# Altium project Signal_Jammer_SMD.PrjPcb
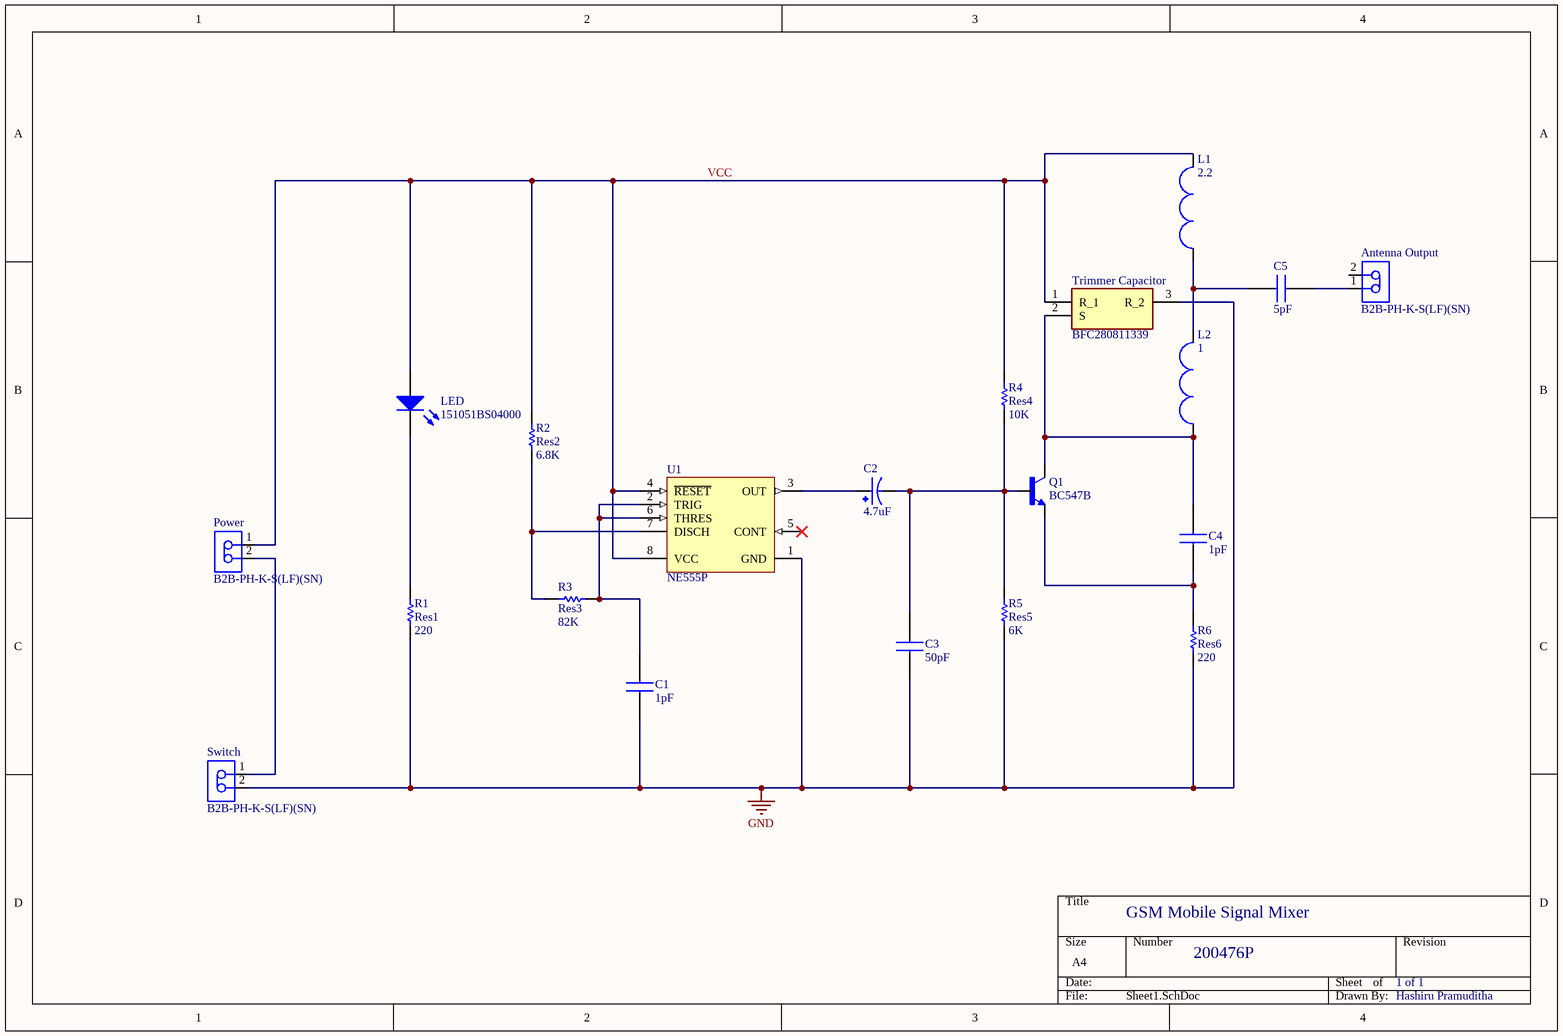
[diagram p0: Sheet1.SchDoc]
1 sheet, 20 parts. Net scope: global (net labels, ports and power ports of the same name join across sheets).
Board file: JammerCircuit_PCB.PcbDoc

## Sheet Sheet1.SchDoc
size A4; SheetNumber: 1; SheetTotal: 1

### Parts
Antenna_Output  B2B-PH-K-S(LF)(SN)  [JST-B2B-PH-K-S_V]
C1  1pF  [RDE5C1H330J0M1H03A]
C2  4.7uF  [CAPPRD250W50D500H1100]
C3  50pF  [RDE5C1H330J0M1H03A]
C4  1pF  [RDE5C1H330J0M1H03A]
C5  5pF  [RDE5C1H330J0M1H03A]
L1  2.2  [Inductor Coil TH]
L2  1  [Inductor Coil TH]
LED  151051BS04000  [Type 5mm]
Power  B2B-PH-K-S(LF)(SN)  [JST-B2B-PH-K-S_V]
Q1  BC547B  [TO92250P510H770-3]
R1  Res1  value 220  [AXIAL-0.3]
R2  Res2  value 6.8K  [AXIAL-0.3]
R3  Res3  value 82K  [AXIAL-0.3]
R4  Res4  value 10K  [AXIAL-0.3]
R5  Res5  value 6K  [AXIAL-0.3]
R6  Res6  value 220  [AXIAL-0.3]
Switch  B2B-PH-K-S(LF)(SN)  [JST-B2B-PH-K-S_V]
Trimmer_Capacitor  BFC280811339  [BFC280811339]
U1  NE555P  [P0008A]

### Nets
GND: C1.1 C3.1 R1.1 R5.1 R6.1 Switch.2 Trimmer_Capacitor.3(R_2) U1.1(GND)
NetAntenna_Output_1: Antenna_Output.1 C5.2
NetC1_2: C1.2 R3.2 U1.2(TRIG) U1.6(THRES)
NetC2_N: C2.N C3.2 Q1.2(B) R4.1 R5.2
NetC2_P: C2.P U1.3(OUT)
NetC4_1: C4.1 Q1.3(E) R6.2
NetC4_2: C4.2 L2.0 Q1.1(C) Trimmer_Capacitor.2(S)
NetC5_1: C5.1 L1.0 L2.1
NetL1_1: L1.1 LED.2(A) Power.1 R2.2 R4.2 Trimmer_Capacitor.1(R_1) U1.4(~{RESET}) U1.8(VCC)
NetLED_1: LED.1(K) R1.2
NetPower_2: Power.2 Switch.1
NetR2_1: R2.1 R3.1 U1.7(DISCH)

Not connected (* = marked no-connect by the designer): Antenna_Output 2; U1 5(CONT)*

### Notes on the sheet
- VCC
- GSM Mobile Signal Mixer
- 200476P
- 1 of 1
- Hashiru Pramuditha

### Library data of the parts
Antenna_Output Power Switch = CMP-2000-05162-1: Male Header, Pitch 2 mm, 1 x 2 Position, Height 6 mm, Tail Length 3.4 mm, -25 to 85 degC, RoHS, Bulk; Manufacturer: JST; Pitch: 2mm; Style/Orientation: StraightHeader/Plug; No of Positions: 2; Datasheet Version: Nov-08; Datasheet URL: http://datasheet.octopart.com/B2B-PH-K-S%28LF%29%28SN%29-JST-datasheet-8324864.pdf; Manufacturer URL: http://www.jst.com/home2.html; Type: ShroudedHeader; Termination: Crimp
C1 C3 C4 = RDE5C1H1R0C0M1H03A: Capacitor L=4.0mm W=3.5mm T=2.5mm; Manufacturer_Name: Murata Electronics; Geometry.Height: 5mm; Mouser Part Number: 81-RDE5C1H1R0C0M1H3A; Mouser Price/Stock: https://www.mouser.com/Search/Refine.aspx?Keyword=81-RDE5C1H1R0C0M1H3A; Manufacturer_Part_Number: RDE5C1H1R0C0M1H03A; Datasheet Link: https://componentsearchengine.com/Datasheets/1/RDE5C1H1R0C0M1H03A.pdf
C2 = EEUEB1J100SH: 10ÂµF 63V Aluminum Electrolytic Capacitors Radial, Can 5000 Hrs @ 105Â°C; MF: Panasonic; Price: None; Check_prices: https://www.snapeda.com/parts/EEUEB1J100SH/Panasonic/view-part/5796687/?ref=eda; Value: *; Package: RADIAL-2 Panasonic; SnapEDA_Link: https://www.snapeda.com/parts/EEUEB1J100SH/Panasonic/view-part/5796687/?ref=snap; MP: EEUEB1J100SH; Availability: In Stock
C5 = RDE5C1H5R0C0K1H03B: Capacitor L=4.0mm W=3.5mm T=2.5mm; Manufacturer_Name: Murata Electronics; Geometry.Height: 5mm; Mouser Part Number: 81-RDE5C1H5R0C0K1H3B; Mouser Price/Stock: https://www.mouser.com/Search/Refine.aspx?Keyword=81-RDE5C1H5R0C0K1H3B; Manufacturer_Part_Number: RDE5C1H5R0C0K1H03B; Datasheet Link: https://componentsearchengine.com/Datasheets/1/RDE5C1H5R0C0K1H03B.pdf
L1 L2 = Inductor
LED = CMP-1488-00009-1: THT LED round mono-color color lens, WL-TMRW, Blue; Manufacturer: Wuerth Elektronik; PackageReference: Type 5mm; ComponentLink2Description: Datasheet; ComponentLink1Description: Manufacturer URL; Emitting color: Blue; ComponentLink1URL: http://www.we-online.com; PartNumber: 151051BS04000; ComponentLink2URL: http://katalog.we-online.de/pbs/datasheet/7448042001.pdfhttp://katalog.we-online.de/pbs/datasheet/7448042001.pdfhttp://katalog.we-online.de/pbs/datasheet/7448042001.pdfhttp://katalog.we-online.de/pbs/datasheet/151051BS04000.pdf
Q1 = BC547B: Bipolar (BJT) TransistÃ¶r NPN 45 V 100 mA 300MHz 625 mW Delikten TO-92 (TO-226); MF: ON Semiconductor; SnapEDA_Link: https://www.snapeda.com/parts/BC547B/Onsemi/view-part/?ref=snap; MP: BC547B; Availability: In Stock; Price: None; Value: *; Check_prices: https://www.snapeda.com/parts/BC547B/Onsemi/view-part/?ref=eda; Package: TO-92-3 ON Semiconductor; Purchase-URL: https://pricing.snapeda.com/search/part/BC547B/?ref=eda
R1-R6 = Res1: Resistor; Published: 8-Jun-2000; LatestRevisionDate: 17-Jul-2002; LatestRevisionNote: Re-released for DXP Platform.; PackageReference: AXIAL-0.3; Publisher: Altium Limited; PackageDescription: Axial Device, Thru-Hole; 2 Leads; 0.3 in Pin Spacing
Trimmer_Capacitor = BFC280811339: CAP TRIMMER 3-33PF 250V TH; Manufacturer_Name: Vishay; Geometry.Height: 10mm; Arrow Part Number: BFC280811339; Arrow Price/Stock: https://www.arrow.com/en/products/bfc280811339/vishay; Manufacturer_Part_Number: BFC280811339; Datasheet Link: https://www.arrow.com/en/products/bfc280811339/vishay
U1 = CMP-2000-04954-1: Precision Timer, 4.5 to 16 V, 0 to 70 degC, 8-Pin DIP, Pb-Free, Tube; Manufacturer: TexasInstruments; Maximum High Level Output Current: -200mA; Number of Internal Timers: 1; Operating Supply Voltage: 5; Maximum Low Level Output Current: 200mA; Rad Hard: No; Packaging: Rail/Tube; Manufacturer URL: http://www.ti.com/; Package Reference: P8; Package Description: 8-Pin Double In-line Package, Body 9.59 x 6.35 mm, Pitch 2.54 mm; Package URL: http://www.ti.com/lit/ml/mpdi001b/mpdi001b.pdf; Type: Standard; Datasheet URL: http://www.ti.com/general/docs/lit/getliterature.tsp?genericPartNumber=NE555&fileType=pdf; Category: Timer; Package: 8PDIP; Datasheet Version: Rev. I, 09/2014